# Altium schematic sheet main.SchDoc
size A
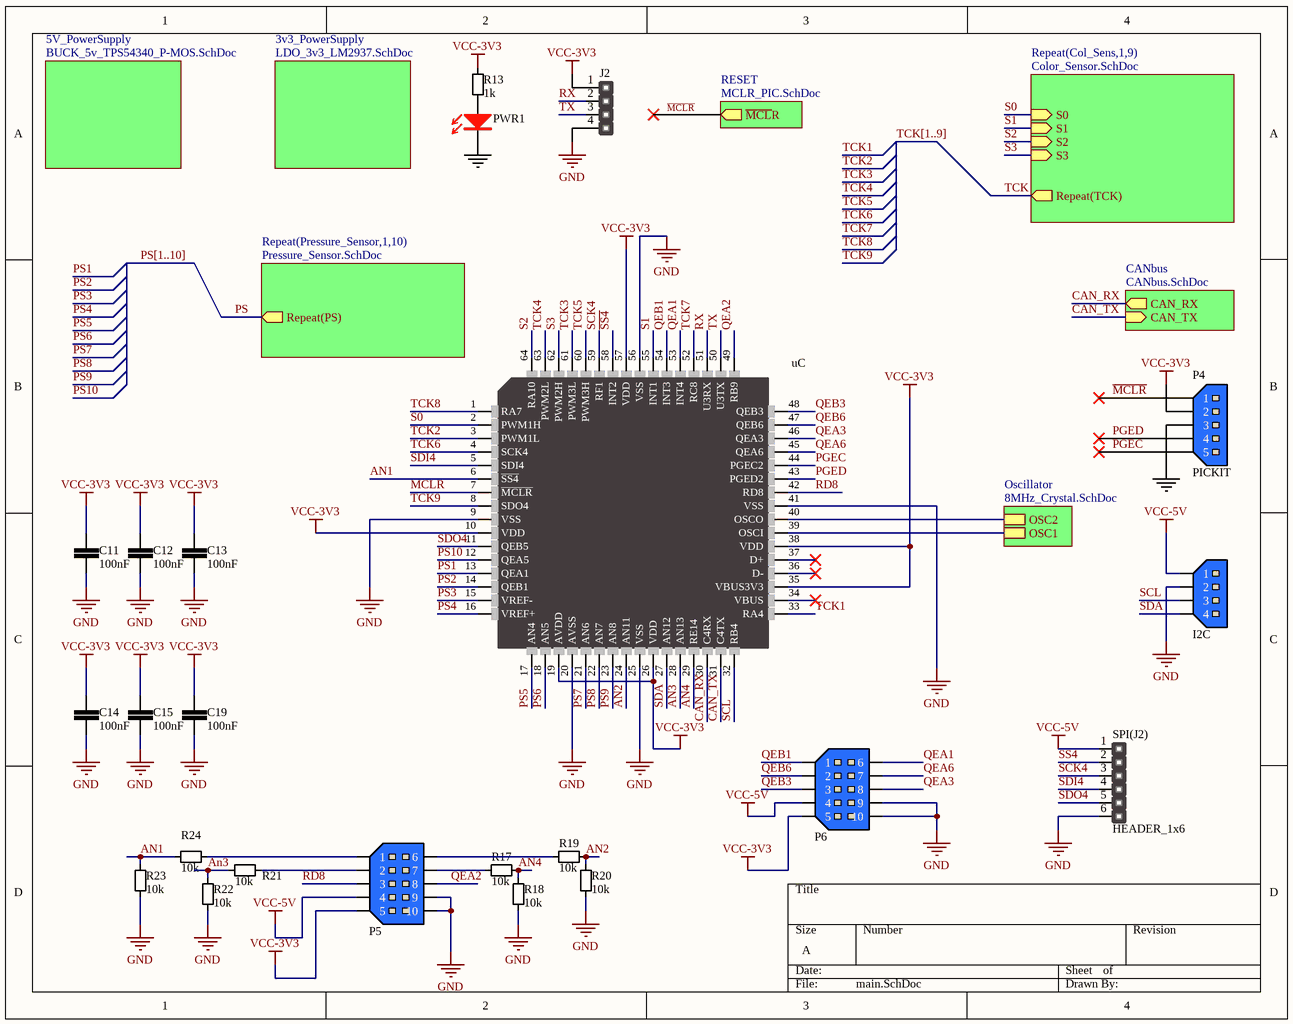
[diagram p0: main.SchDoc]

## Parts
C11  100nF  [CER_0805]
C12  100nF  [CER_0805]
C13  100nF  [CER_0805]
C14  100nF  [CER_0805]
C15  100nF  [CER_0805]
C19  100nF  [CER_0805]
I2C  TE CONNECTIVITY_4PIN_MALE  [TE CONNECTIVITY_4PIN_MALE]  (value not drawn)
J2  HEADER_1x4  [HM1X4]  (value not drawn)
P4  PICKIT  [TE CONNECTIVITY_5PIN_MALE]
P5  TE CONNECTIVITY_5PIN_MALE_1  [TE CONNECTIVITY_10PIN_MALE]  (value not drawn)
P6  TE CONNECTIVITY_5PIN_MALE_1  [TE CONNECTIVITY_10PIN_MALE]  (value not drawn)
PWR1  LED RED  [LED_RED_0805]  (value not drawn)
R13  1k  [RESC2013X38N-0805-NOOVERLAY]
R17  10k  [RESC2013X38N-0805-NOOVERLAY]
R18  10k  [RESC2013X38N-0805-NOOVERLAY]
R19  10k  [RESC2013X38N-0805-NOOVERLAY]
R20  10k  [RESC2013X38N-0805-NOOVERLAY]
R21  10k  [RESC2013X38N-0805-NOOVERLAY]
R22  10k  [RESC2013X38N-0805-NOOVERLAY]
R23  10k  [RESC2013X38N-0805-NOOVERLAY]
R24  10k  [RESC2013X38N-0805-NOOVERLAY]
SPI(J2)  HEADER_1x6  [HM1X6]
uC  (no value)  [TQFP-64-500um]

## Sub-sheets
3v3_PowerSupply = LDO_3v3_LM2937.SchDoc: no entries
5V_PowerSupply = BUCK_5v_TPS54340_P-MOS.SchDoc: no entries
CANbus = CANbus.SchDoc: CAN_TX (in), CAN_RX (out)
Oscillator = 8MHz_Crystal.SchDoc: OSC1, OSC2
Repeat(Col_Sens,1,9) = Color_Sensor.SchDoc: S0 (in), S1 (in), S2 (in), S3 (in), Repeat(TCK) (out)
Repeat(Pressure_Sensor,1,10) = Pressure_Sensor.SchDoc: Repeat(PS) (out)
RESET = MCLR_PIC.SchDoc: ~{MCL}R (out)

## Nets
GND: C11.1 C12.1 C13.1 C14.1 C15.1 C19.1 I2C.2 J2.4 P4.3 P5.9 P5.10 P6.9 P6.10 PWR1.1(C) R18.1 R20.1 R22.1 R23.1 SPI(J2).6 uC.9(VSS) uC.20(AVSS) uC.25(VSS) uC.41(VSS) uC.56(VSS)
VCC-3V3: C11.2 C12.2 C13.2 C14.2 C15.2 C19.2 J2.1 P4.2 P5.5 P6.5 R13.2 uC.10(VDD) uC.19(AVDD) uC.26(VDD) uC.35(VBUS3V3) uC.38(VDD) uC.57(VDD)
VCC-5V: I2C.1 P5.4 P6.4 SPI(J2).1
AN1: R23.2 R24.2 uC.6(~{SS4})
AN2: R19.1 R20.2 uC.24(AN11)
AN3: R21.2 R22.2 uC.28(AN13)
AN4: R17.1 R18.2 uC.29(RE14)
CAN_RX: uC.30(C4RX) ; sheet CANbus/CAN_RX
CAN_TX: uC.31(C4TX) ; sheet CANbus/CAN_TX
~{MCLR}: P4.1 uC.7(~{MCLR}) ; sheet RESET/~{MCL}R
PGEC: P4.5 uC.44(PGEC2)
PGED: P4.4 uC.43(PGED2)
PS: sheet Repeat(Pressure_Sensor,1,10)/Repeat(PS)
PS1: uC.13(QEA1)
PS2: uC.14(QEB1)
PS3: uC.15(VREF-)
PS4: uC.16(VREF+)
PS5: uC.17(AN4)
PS6: uC.18(AN5)
PS7: uC.21(AN6)
PS8: uC.22(AN7)
PS9: uC.23(AN8)
PS10: uC.12(QEA5)
QEA1: P6.6 uC.53(INT4)
QEA2: P5.8 uC.49(RB9)
QEA3: P6.8 uC.46(QEA3)
QEA6: P6.7 uC.45(QEA6)
QEB1: P6.1 uC.54(INT3)
QEB3: P6.3 uC.48(QEB3)
QEB6: P6.2 uC.47(QEB6)
RD8: P5.3 uC.42(RD8)
RX: J2.2 uC.51(U3RX)
S0: uC.2(PWM1H) ; sheet Repeat(Col_Sens,1,9)/S0
S1: uC.55(INT1) ; sheet Repeat(Col_Sens,1,9)/S1
S2: uC.64(RA10) ; sheet Repeat(Col_Sens,1,9)/S2
S3: uC.62(PWM2H) ; sheet Repeat(Col_Sens,1,9)/S3
~{SS4}: SPI(J2).2 uC.58(INT2)
SCK4: SPI(J2).3 uC.59(RF1)
SCL: I2C.3 uC.32(RB4)
SDA: I2C.4 uC.27(AN12)
SDI4: SPI(J2).4 uC.5(SDI4)
SDO4: SPI(J2).5 uC.11(QEB5)
TCK: sheet Repeat(Col_Sens,1,9)/Repeat(TCK)
TCK1: uC.33(RA4)
TCK2: uC.3(PWM1L)
TCK3: uC.61(PWM3L)
TCK4: uC.63(PWM2L)
TCK5: uC.60(PWM3H)
TCK6: uC.4(SCK4)
TCK7: uC.52(RC8)
TCK8: uC.1(RA7)
TCK9: uC.8(SDO4)
TX: J2.3 uC.50(U3TX)
NetP5_1: P5.1 R24.1
NetP5_2: P5.2 R21.1
NetP5_6: P5.6 R19.2
NetP5_7: P5.7 R17.2
NetPWR1_2: PWR1.2(A) R13.1
NetuC_39: uC.39(OSCI) ; sheet Oscillator/OSC1
NetuC_40: uC.40(OSCO) ; sheet Oscillator/OSC2

Not connected (* = marked no-connect by the designer): uC 34(VBUS)* 36(D-)* 37(D+)*

## Buses and harness runs
bus PS[1..10]
bus TCK[1..9]

## Library data of the parts
C11 = 00002105_1: CAP CER 1n 50V X7R 10% 0805; Capacitance: 1nF
C12-C15 C19 = 00002105: CAP CER 100n 50V X7R 10% 0805; Capacitance: 100nF
I2C = TE CONNECTIVITY_4PIN_MALE: BLUE_4PIN_CONECTOR; Manufacturer: TE CONNECTIVITY / AMP; Manufacturer Part Number 1: 281695-3; Order Code 1: 1205983; Price 1: L0.403; Supplier 1: uk.farnell.com
P4 = TE CONNECTIVITY_5PIN_MALE: BLUE_5PIN_CONECTOR; Manufacturer: TE CONNECTIVITY / AMP; Manufacturer Part Number 1: 281695-3; Order Code 1: 1205983; Price 1: £0.403; Supplier 1: uk.farnell.com
P5 P6 = TE CONNECTIVITY_5PIN_MALE_1: BLUE_10PIN_CONECTOR; Manufacturer: TE CONNECTIVITY / AMP; Manufacturer Part Number 1: 281739-5; Order Code 1: j; Price 1: £0.403; Supplier 1: https://www.tme.eu/gb/details/281739-5/raster-signal-connectors-254mm/te-connectivity/
PWR1 = LED_RED_0805: LED RED 0805; Manufacturer: BRIGHT LED ELECTRONICS; Manufacturer Part Number: BL-HUB35A-AV-TRB; Barcode: 2911010024321; id: 35; Assembly: SMD; Voltage Forward: 2.0 V; item_id: 3341; Recommended Rating: Platinum; Package Case: 0805 (2012 Metric); Color: Red; Family: LED; Part Type: Optoelectronics
R13 = 00001001: RES SMD 1 kOhm 1/8W 0805; Power: 0.125W, 1/8W; Barcode: 00009101; Resistance: 1k; Assembly: SMD
R17-R24 = 00001001: RES SMD 1 kOhm 1/8W 0805; Resistance: 1k; Power: 0.125W, 1/8W; Barcode: 00009101; Assembly: SMD
uC = PIC32MK1024MCF064: IC MCU 32BIT 1MB FLASH 64TQFP; Manufacturer Part Number: PIC32MK1024MCF064